# Altium schematic sheet LM317G.schdoc
size 52 x 37 mm
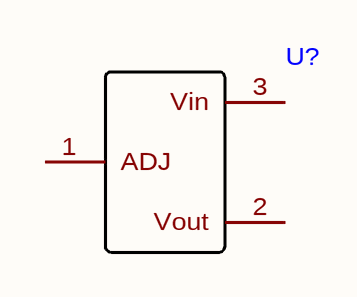
[diagram p0: LM317G.schdoc]

## Parts
U?  (no value)  [TO-252-2_L6.6-W6.1-P4.57-LS9.9-TL-CW]

## Nets

Not connected (* = marked no-connect by the designer): U? 1(ADJ) 2(Vout) 3(Vin)

## Library data of the parts
U? = LM317G-TN3-R